# Altium schematic sheet main.SchDoc
size A4
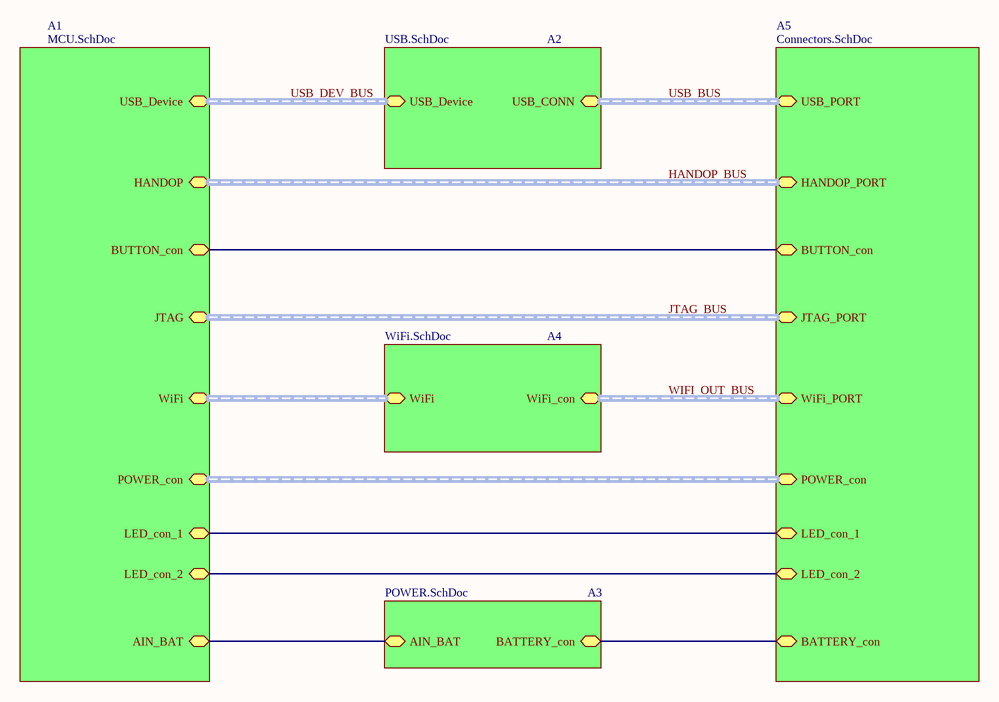
[diagram p0: main.SchDoc]

## Sub-sheets
A1 = MCU.SchDoc: USB_Device (harness USB), WiFi (harness WiFi), AIN_BAT, HANDOP (harness HANDOP_connector), BUTTON_con, LED_con_1, POWER_con (harness POWER), JTAG (harness JTAG_connector), LED_con_2
A2 = USB.SchDoc: USB_Device (harness USB), USB_CONN (harness USB_connector)
A3 = POWER.SchDoc: AIN_BAT, BATTERY_con
A4 = WiFi.SchDoc: WiFi (harness WiFi), WiFi_con (harness WiFi_connector)
A5 = Connectors.SchDoc: WiFi_PORT (harness WiFi_connector), BATTERY_con, HANDOP_PORT (harness HANDOP_connector), BUTTON_con, LED_con_1, POWER_con (harness POWER), JTAG_PORT (harness JTAG_connector), USB_PORT (harness USB_connector), LED_con_2

## Nets
(unnamed): sheet A1/AIN_BAT, sheet A3/AIN_BAT
(unnamed): sheet A1/BUTTON_con, sheet A5/BUTTON_con
(unnamed): sheet A1/LED_con_1, sheet A5/LED_con_1
(unnamed): sheet A1/LED_con_2, sheet A5/LED_con_2
(unnamed): sheet A3/BATTERY_con, sheet A5/BATTERY_con

## Buses and harness runs
harness HANDOP_BUS = sheet A1/HANDOP = sheet A5/HANDOP_PORT
harness JTAG_BUS = sheet A1/JTAG = sheet A5/JTAG_PORT
harness sheet A1/POWER_con = sheet A5/POWER_con
harness sheet A1/WiFi = sheet A4/WiFi
harness USB_BUS = sheet A2/USB_CONN = sheet A5/USB_PORT
harness USB_DEV_BUS = sheet A1/USB_Device = sheet A2/USB_Device
harness WIFI_OUT_BUS = sheet A4/WiFi_con = sheet A5/WiFi_PORT